# Altium project roneCPUBoard-v12.PrjPCB
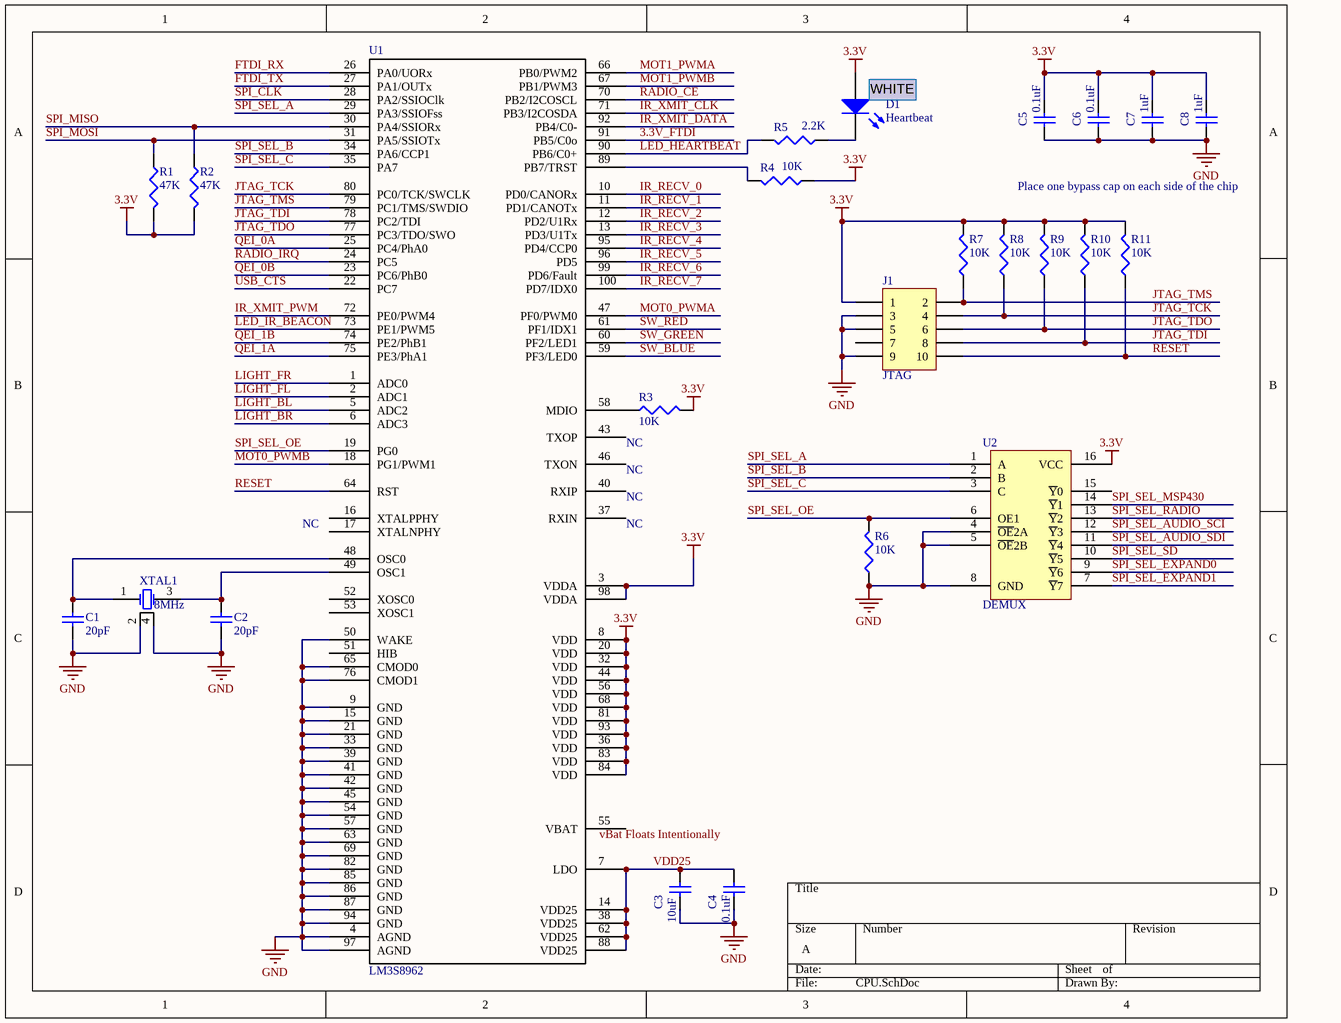
[diagram p0: CPU.SchDoc]
5 sheets, 126 parts. Net scope: global (net labels, ports and power ports of the same name join across sheets).
Board file: roneCPUBoard-v12.PcbDoc
Sheets:
  CPU.SchDoc
  USBHeaders.SchDoc
  LEDs.SchDoc
  LightSensorsButtons.SchDoc
  SoundChip.SchDoc

## Sheet CPU.SchDoc
size A; PageSetup: Record=PageOptions|CenterHorizontal=True|CenterVertical=True|PrintScale=1.05|XCorrection=1.00|YCorrection=1.00|PrintKind=1|BorderSize=5000000|LeftOffset=0|BottomOffset=0|Orientation=2|PaperLength=1000|PaperWidth=1000|Scale=100|PaperSource=262|PrintQuality=600|MediaType=1|DitherType=10|PaperKind=Letter|PrintScaleMode=1

### Parts
C1  value 20pF  [CAPC1005L]  (hidden comment: Cap Semi)
C2  value 20pF  [CAPC1005L]  (hidden comment: Cap Semi)
C3  value 10uF  [CAPC1608L]  (hidden comment: Cap Semi)
C4  value 0.1uF  [CAPC1005L]  (hidden comment: Cap Semi)
C5  value 0.1uF  [CAPC1005L]  (hidden comment: Cap Semi)
C6  value 0.1uF  [CAPC1005L]  (hidden comment: Cap Semi)
C7  value 1uF  [CAPC1608L]  (hidden comment: Cap Semi)
C8  value 1uF  [CAPC1608L]  (hidden comment: Cap Semi)
D1  Heartbeat  [SurfaceMount(603)]
J1  JTAG  [JTAG-10]
R1  value 47K  [RESC1608L]  (hidden comment: Res3)
R2  value 47K  [RESC1608L]  (hidden comment: Res3)
R3  value 10K  [RESC1608L]  (hidden comment: Res3)
R4  value 10K  [RESC1608L]  (hidden comment: Res3)
R5  value 2.2K  [RESC1608L]  (hidden comment: Res3)
R6  value 10K  [RESC1608L]  (hidden comment: Res3)
R7  value 10K  [RESC1608L]  (hidden comment: Res3)
R8  value 10K  [RESC1608L]  (hidden comment: Res3)
R9  value 10K  [RESC1608L]  (hidden comment: Res3)
R10  value 10K  [RESC1608L]  (hidden comment: Res3)
R11  value 10K  [RESC1608L]  (hidden comment: Res3)
U1  LM3S8962  [LQFP-100]
U2  DEMUX  [TSSOP-16]
XTAL1  8MHz  [CRYSTAL]

### Nets
3.3V: C5.2 C6.2 C7.2 C8.2 D1.1(A) J1.1 R1.2 R2.2 R3.2 R4.1 R7.2 R8.2 R9.2 R10.2 R11.2 U1.3(VDDA) U1.8(VDD) U1.20(VDD) U1.32(VDD) U1.36(VDD) U1.44(VDD) U1.56(VDD) U1.68(VDD) U1.81(VDD) U1.83(VDD) U1.84(VDD) U1.93(VDD) U1.98(VDDA) U2.16(VCC)
3.3V_FTDI: U1.91(PB5/C0o)
GND: C1.1 C2.1 C3.1 C4.1 C5.1 C6.1 C7.1 C8.1 J1.3 J1.5 J1.9 R6.1 U1.4(AGND) U1.9(GND) U1.15(GND) U1.21(GND) U1.33(GND) U1.39(GND) U1.41(GND) U1.42(GND) U1.45(GND) U1.50(WAKE) U1.54(GND) U1.57(GND) U1.63(GND) U1.65(CMOD0) U1.69(GND) U1.76(CMOD1) U1.82(GND) U1.85(GND) U1.86(GND) U1.87(GND) U1.94(GND) U1.97(AGND) U2.4(~{OE}2A) U2.5(~{OE}2B) U2.8(GND) XTAL1.2(GND) XTAL1.4(GND)
FTDI_RX: U1.26(PA0/UORx)
FTDI_TX: U1.27(PA1/OUTx)
IR_RECV_0: U1.10(PD0/CANORx)
IR_RECV_1: U1.11(PD1/CANOTx)
IR_RECV_2: U1.12(PD2/U1Rx)
IR_RECV_3: U1.13(PD3/U1Tx)
IR_RECV_4: U1.95(PD4/CCP0)
IR_RECV_5: U1.96(PD5)
IR_RECV_6: U1.99(PD6/Fault)
IR_RECV_7: U1.100(PD7/IDX0)
IR_XMIT_CLK: U1.71(PB3/I2COSDA)
IR_XMIT_DATA: U1.92(PB4/C0-)
IR_XMIT_PWM: U1.72(PE0/PWM4)
JTAG_TCK: J1.4 R8.1 U1.80(PC0/TCK/SWCLK)
JTAG_TDI: J1.8 R10.1 U1.78(PC2/TDI)
JTAG_TDO: J1.6 R9.1 U1.77(PC3/TDO/SWO)
JTAG_TMS: J1.2 R7.1 U1.79(PC1/TMS/SWDIO)
LED_HEARTBEAT: R5.2 U1.90(PB6/C0+)
LED_IR_BEACON: U1.73(PE1/PWM5)
LIGHT_BL: U1.5(ADC2)
LIGHT_BR: U1.6(ADC3)
LIGHT_FL: U1.2(ADC1)
LIGHT_FR: U1.1(ADC0)
MOT0_PWMA: U1.47(PF0/PWM0)
MOT0_PWMB: U1.18(PG1/PWM1)
MOT1_PWMA: U1.66(PB0/PWM2)
MOT1_PWMB: U1.67(PB1/PWM3)
QEI_0A: U1.25(PC4/PhA0)
QEI_0B: U1.23(PC6/PhB0)
QEI_1A: U1.75(PE3/PhA1)
QEI_1B: U1.74(PE2/PhB1)
RADIO_CE: U1.70(PB2/I2COSCL)
RADIO_IRQ: U1.24(PC5)
RESET: J1.10 R11.1 U1.64(RST)
SPI_CLK: U1.28(PA2/SSIOClk)
SPI_MISO: R2.1 U1.30(PA4/SSIORx)
SPI_MOSI: R1.1 U1.31(PA5/SSIOTx)
SPI_SEL_A: U1.29(PA3/SSIOFss) U2.1(A)
SPI_SEL_AUDIO_SCI: U2.12(~{Y}3)
SPI_SEL_AUDIO_SDI: U2.11(~{Y}4)
SPI_SEL_B: U1.34(PA6/CCP1) U2.2(B)
SPI_SEL_C: U1.35(PA7) U2.3(C)
SPI_SEL_EXPAND0: U2.9(~{Y}6)
SPI_SEL_EXPAND1: U2.7(~{Y}7)
SPI_SEL_MSP430: U2.14(~{Y}1)
SPI_SEL_OE: R6.2 U1.19(PG0) U2.6(OE1)
SPI_SEL_RADIO: U2.13(~{Y}2)
SPI_SEL_SD: U2.10(~{Y}5)
SW_BLUE: U1.59(PF3/LED0)
SW_GREEN: U1.60(PF2/LED1)
SW_RED: U1.61(PF1/IDX1)
USB_CTS: U1.22(PC7)
VDD25: C3.2 C4.2 U1.7(LDO) U1.14(VDD25) U1.38(VDD25) U1.62(VDD25) U1.88(VDD25)
NetC1_2: C1.2 U1.48(OSC0) XTAL1.1(OSC1)
NetC2_2: C2.2 U1.49(OSC1) XTAL1.3(OSC2)
NetD1_2: D1.2(K) R5.1
NetR3_1: R3.1 U1.58(MDIO)
NetR4_2: R4.2 U1.89(PB7/TRST)

Not connected (* = marked no-connect by the designer): J1 7; U1 16(XTALPPHY) 17(XTALNPHY) 37(RXIN) 40(RXIP) 43(TXOP) 46(TXON) 51(HIB) 52(XOSC0) 53(XOSC1) 55(VBAT); U2 15(~{Y}0)

### Notes on the sheet
- (near D1) WHITE
- Place one bypass cap on each side of the chip
- NC
- (near U1) NC
- (near U1) vBat Floats Intentionally

### Library data of the parts
C1-C8 = Cap Semi: Capacitor (Semiconductor SIM Model); Published: 8-Jun-2000; LatestRevisionDate: 29-May-2009; LatestRevisionNote: IPC-7351 Footprint Added.; PackageReference: C1206; Publisher: Altium Limited; PackageDescription: Chip Capacitor
D1 = LED
J1 = Header 5X2H: Header, 5-Pin, Dual row, Right Angle; LatestRevisionDate: 17-Jul-2002; LatestRevisionNote: Re-released for DXP Platform.; Publisher: Altium Limited
R1-R11 = Res3: Resistor; Published: 8-Jun-2000; LatestRevisionDate: 29-May-2009; LatestRevisionNote: IPC-7351 Footprint Added.; PackageReference: J1-0603; Publisher: Altium Limited; PackageDescription: Chip Resistor
XTAL1 = Crystal

## Sheet USBHeaders.SchDoc
size A
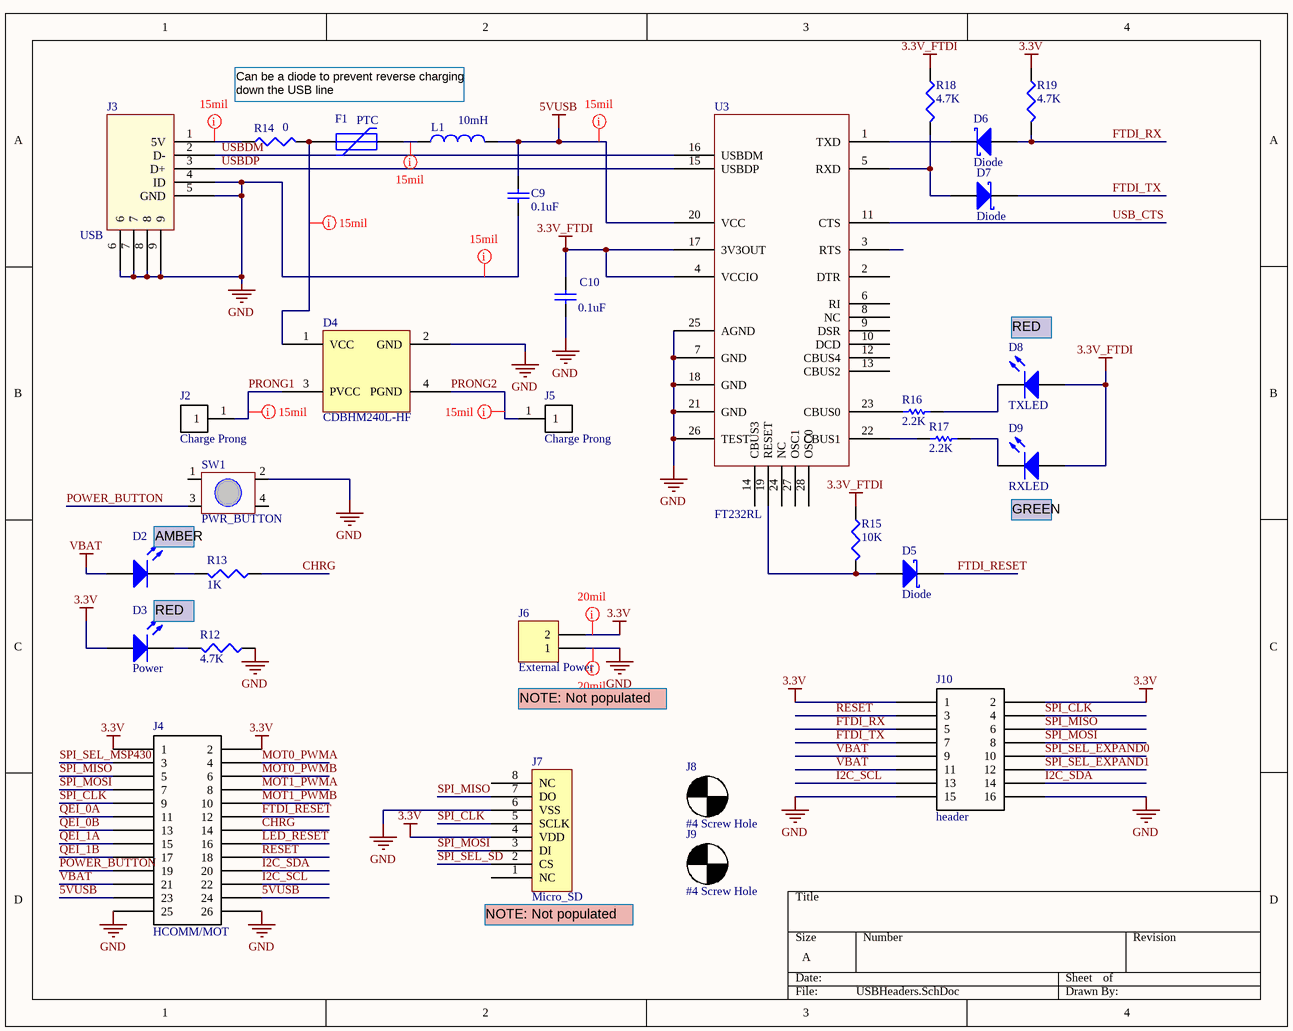
[diagram p1: USBHeaders.SchDoc]

### Parts
C9  value 0.1uF  [CAPC1005L]
C10  value 0.1uF  [CAPC1005L]
D2  Charge  [SurfaceMount(603)]  (value not drawn)
D3  Power  [SurfaceMount(603)]
D4  CDBHM240L-HF  [DIODEARRAY_2AMPS]
D5  Diode  [SurfaceMount(603)]
D6  Diode  [SurfaceMount(603)]
D7  Diode  [SurfaceMount(603)]
D8  TXLED  [SurfaceMount(603)]
D9  RXLED  [SurfaceMount(603)]
F1  PTC  [ERJ8G-1206]
J2  Charge Prong  [CHARGING_PRONG]
J3  USB  [USB Minib (thru-hole)]
J4  HCOMM/MOT  [HeaderSM 13x2]
J5  Charge Prong  [CHARGING_PRONG]
J6  External Power  [HDR1X2]
J7  Micro_SD  [MICRO_SD]
J8  #4 Screw Hole  [#4_Screw_Hole]
J9  #4 Screw Hole  [#4_Screw_Hole]
J10  header  [HEADERSM 8X2]
L1  value 10mH  [INDC2012L]  (hidden comment: Inductor)
R12  value 4.7K  [RESC1608L]  (hidden comment: Res3)
R13  value 1K  [RESC1608L]  (hidden comment: Res3)
R14  value 0  [RESC1608L]  (hidden comment: Res3)
R15  value 10K  [RESC1608L]  (hidden comment: Res3)
R16  value 2.2K  [RESC1608L]
R17  value 2.2K  [RESC1608L]
R18  value 4.7K  [RESC1608L]  (hidden comment: Res3)
R19  value 4.7K  [RESC1608L]  (hidden comment: Res3)
SW1  PWR_BUTTON  [SwitchTall-TL330]
U3  FT232RL  [SSOP-28]

### Nets
3.3V: D3.1(A) J4.1 J4.2 J6.2 J7.4(VDD) J10.1 J10.2 R19.1
3.3V_FTDI: C10.2 D8.1(A) D9.1(A) R15.1 R18.1 U3.4(VCCIO) U3.17(3V3OUT)
5VUSB: C9.2 J4.23 J4.24 L1.2 U3.20(VCC)
GND: C9.1 C10.1 D4.2(GND) J3.4(ID) J3.5(GND) J3.6 J3.7 J3.8 J3.9 J4.25 J4.26 J6.1 J7.6(VSS) J10.15 J10.16 R12.1 SW1.2 U3.7(GND) U3.18(GND) U3.21(GND) U3.25(AGND) U3.26(TEST)
VBAT: D2.1(A) J4.21 J10.9 J10.11
CHRG: J4.14 R13.1
FTDI_RESET: D5.1(K) J4.12
FTDI_RX: D6.2(A) J10.5 R19.2
FTDI_TX: D7.1(K) J10.7
I2C_SCL: J4.22 J10.13
I2C_SDA: J4.20 J10.14
LED_RESET: J4.16
MOT0_PWMA: J4.4
MOT0_PWMB: J4.6
MOT1_PWMA: J4.8
MOT1_PWMB: J4.10
POWER_BUTTON: J4.19 SW1.3
PRONG1: D4.3(PVCC) J2.1
PRONG2: D4.4(PGND) J5.1
QEI_0A: J4.11
QEI_0B: J4.13
QEI_1A: J4.15
QEI_1B: J4.17
RESET: J4.18 J10.3
SPI_CLK: J4.9 J7.5(SCLK) J10.4
SPI_MISO: J4.5 J7.7(DO) J10.6
SPI_MOSI: J4.7 J7.3(DI) J10.8
SPI_SEL_EXPAND0: J10.10
SPI_SEL_EXPAND1: J10.12
SPI_SEL_MSP430: J4.3
SPI_SEL_SD: J7.2(CS)
USB_CTS: U3.11(CTS)
USBDM: J3.2(D-) U3.16(USBDM)
USBDP: J3.3(D+) U3.15(USBDP)
NetD2_2: D2.2(K) R13.2
NetD3_2: D3.2(K) R12.2
NetD4_1: D4.1(VCC) F1.2 R14.2
NetD5_2: D5.2(A) R15.2 U3.19(RESET)
NetD6_1: D6.1(K) U3.1(TXD)
NetD7_2: D7.2(A) R18.2 U3.5(RXD)
NetD8_2: D8.2(K) R16.2
NetD9_2: D9.2(K) R17.2
NetF1_1: F1.1 L1.1
NetJ3_1: J3.1(5V) R14.1
NetR16_1: R16.1 U3.23(CBUS0)
NetR17_1: R17.1 U3.22(CBUS1)

Not connected (* = marked no-connect by the designer): J7 1(NC) 8(NC); SW1 1 4; U3 2(DTR) 3(RTS) 6(RI) 8(NC) 9(DSR) 10(DCD) 12(CBUS4) 13(CBUS2) 14(CBUS3) 24(NC) 27(OSC1) 28(OSC0)

### Layout directives
rule Width Constraint [Pref Width = 15mil    Min Width = 8mil    Max Width = 30mil]: 3.3V
rule Width Constraint [Pref Width = 8mil    Min Width = 8mil    Max Width = 15mil]: 5VUSB, GND, NetJ3_1
rule Width Constraint [Pref Width = 15mil    Min Width = 15mil    Max Width = 20mil]: NetD4_1, NetF1_1
rule Width Constraint [Pref Width = 15mil    Min Width = 8mil    Max Width = 20mil]: PRONG1, PRONG2
rule Width Constraint [Pref Width = 15mil    Min Width = 8mil    Max Width = 100mil]: GND

### Notes on the sheet
- Can be a diode to prevent reverse charging down the USB line
- (near D8) RED
- (near D9) GREEN
- AMBER
- RED
- (near J6) NOTE: Not populated
- (near J7) NOTE: Not populated

### Library data of the parts
C9 C10 = Cap: Capacitor; Published: 8-Jun-2000; LatestRevisionDate: 17-Jul-2002; LatestRevisionNote: Re-released for DXP Platform.; PackageReference: RAD-0.3; Publisher: Altium Limited
D2 D8 D9 = LED2: Typical RED, GREEN, YELLOW, AMBER GaAs LED; Published: 8-Jun-2000; LatestRevisionDate: 17-Jul-2002; LatestRevisionNote: Re-released for DXP Platform.; PackageVersion: Feb-2002; PackageReference: 3.2X1.6X1.1; Publisher: Altium Limited
D3 = LED
D4 = DiodeArray2Amps: MPN: CDBHM240L-HF
D5-D7 = SchottkeyDiode
F1 = PTC_FUSE: Fuse; Published: 8-Jun-2000; LatestRevisionDate: 17-Jul-2002; LatestRevisionNote: Re-released for DXP Platform.; PackageReference: PIN-W2/E2.8; Publisher: Altium Limited
J2 J5 = CHARGE_PRONG: Charging Prong Hole with Plating
J3 = USB-ConnTH
J4 = HCOMM/HMOT: Header, 2X20, 50mil, IDC
J6 = Header 2: Header, 2-Pin; LatestRevisionDate: 17-Jul-2002; LatestRevisionNote: Re-released for DXP Platform.; Publisher: Altium Limited
J8 J9 = Mechanical_Hole: A mechanical hole for mounting the board
J10 = HEADER 8X2
L1 = Inductor: Code_IEC: 1005; Published: 8-Jun-2000; LatestRevisionDate: 29-May-2009; LatestRevisionNote: IPC-7351 Footprint Added.; PackageReference: 0402-A; Publisher: Altium Limited; PackageDescription: Chip Inductor; Code_JEITA: 0402
R12-R15 R18 R19 = Res3: Resistor; Published: 8-Jun-2000; LatestRevisionDate: 29-May-2009; LatestRevisionNote: IPC-7351 Footprint Added.; PackageReference: J1-0603; Publisher: Altium Limited; PackageDescription: Chip Resistor
R16 R17 = Res1: Resistor; Published: 8-Jun-2000; LatestRevisionDate: 17-Jul-2002; LatestRevisionNote: Re-released for DXP Platform.; PackageReference: AXIAL-0.3; Publisher: Altium Limited
SW1 = Switch-TL330

## Sheet LEDs.SchDoc
size A
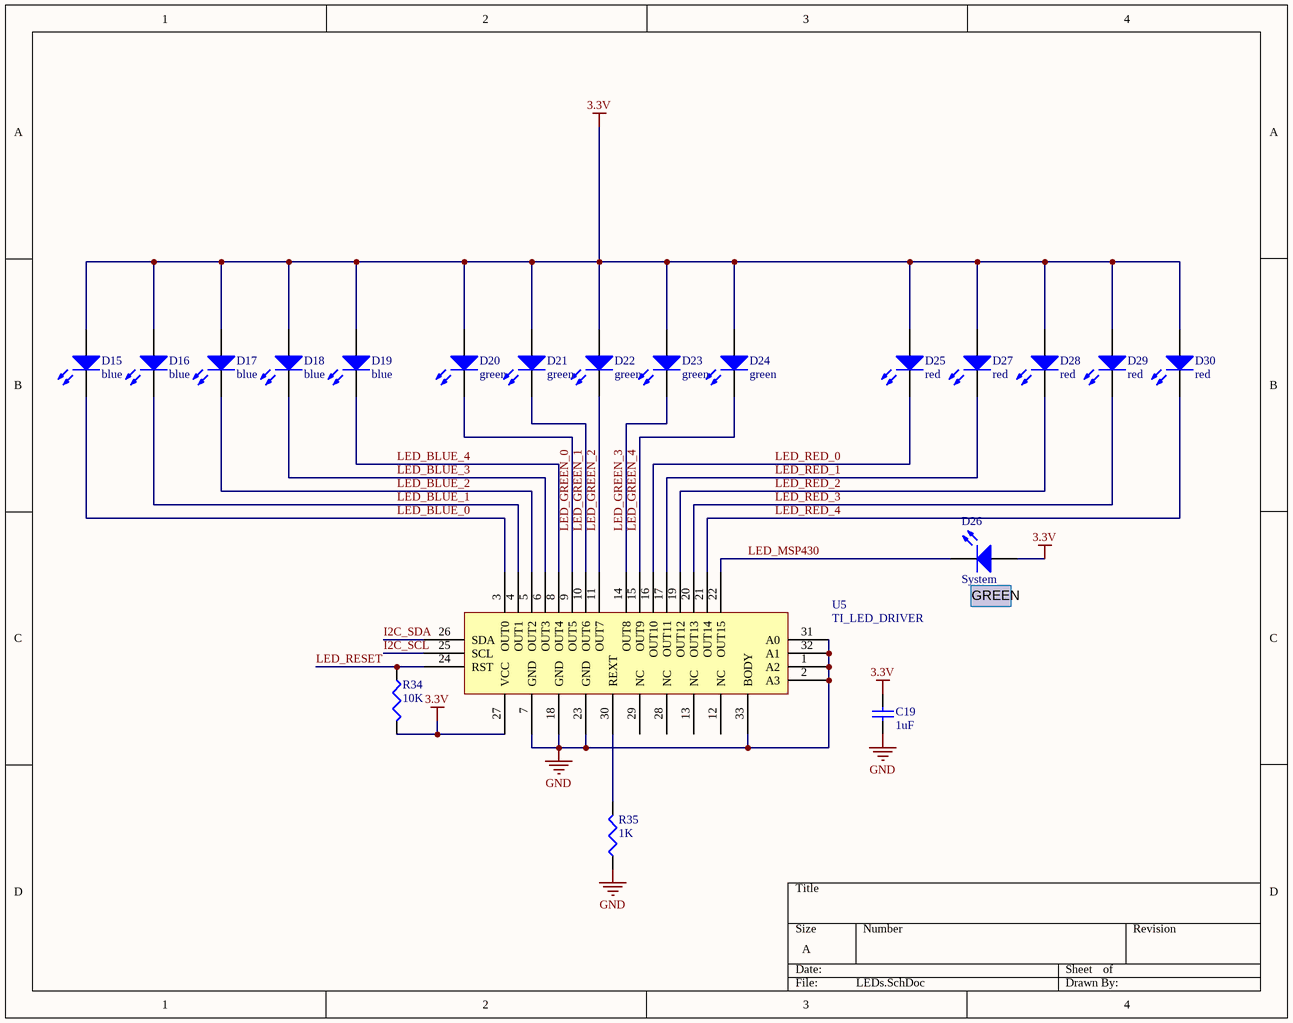
[diagram p2: LEDs.SchDoc]

### Parts
C19  value 1uF  [CAPC1608L]  (hidden comment: Cap Semi)
D15  blue  [SurfaceMount(603)]
D16  blue  [SurfaceMount(603)]
D17  blue  [SurfaceMount(603)]
D18  blue  [SurfaceMount(603)]
D19  blue  [SurfaceMount(603)]
D20  green  [SurfaceMount(603)]
D21  green  [SurfaceMount(603)]
D22  green  [SurfaceMount(603)]
D23  green  [SurfaceMount(603)]
D24  green  [SurfaceMount(603)]
D25  red  [SurfaceMount(603)]
D26  System  [SurfaceMount(603)]
D27  red  [SurfaceMount(603)]
D28  red  [SurfaceMount(603)]
D29  red  [SurfaceMount(603)]
D30  red  [SurfaceMount(603)]
R34  value 10K  [RESC1608L]  (hidden comment: Res3)
R35  value 1K  [RESC1608L]  (hidden comment: Res3)
U5  TI_LED_DRIVER  [QFN32-LEDTLC59116]

### Nets
3.3V: C19.2 D15.1(A) D16.1(A) D17.1(A) D18.1(A) D19.1(A) D20.1(A) D21.1(A) D22.1(A) D23.1(A) D24.1(A) D25.1(A) D26.1(A) D27.1(A) D28.1(A) D29.1(A) D30.1(A) R34.2 U5.27(VCC)
GND: C19.1 R35.1 U5.1(A2) U5.2(A3) U5.7(GND) U5.18(GND) U5.23(GND) U5.31(A0) U5.32(A1) U5.33(BODY)
I2C_SCL: U5.25(SCL)
I2C_SDA: U5.26(SDA)
LED_BLUE_0: D15.2(K) U5.3(OUT0)
LED_BLUE_1: D16.2(K) U5.4(OUT1)
LED_BLUE_2: D17.2(K) U5.5(OUT2)
LED_BLUE_3: D18.2(K) U5.6(OUT3)
LED_BLUE_4: D19.2(K) U5.8(OUT4)
LED_GREEN_0: D20.2(K) U5.9(OUT5)
LED_GREEN_1: D21.2(K) U5.10(OUT6)
LED_GREEN_2: D22.2(K) U5.11(OUT7)
LED_GREEN_3: D23.2(K) U5.14(OUT8)
LED_GREEN_4: D24.2(K) U5.15(OUT9)
LED_MSP430: D26.2(K) U5.22(OUT15)
LED_RED_0: D25.2(K) U5.16(OUT10)
LED_RED_1: D27.2(K) U5.17(OUT11)
LED_RED_2: D28.2(K) U5.19(OUT12)
LED_RED_3: D29.2(K) U5.20(OUT13)
LED_RED_4: D30.2(K) U5.21(OUT14)
LED_RESET: R34.1 U5.24(RST)
NetR35_2: R35.2 U5.30(REXT)

Not connected (* = marked no-connect by the designer): U5 12(NC) 13(NC) 28(NC) 29(NC)

### Notes on the sheet
- (near D26) GREEN

### Library data of the parts
C19 = Cap Semi: Capacitor (Semiconductor SIM Model); Published: 8-Jun-2000; LatestRevisionDate: 29-May-2009; LatestRevisionNote: IPC-7351 Footprint Added.; PackageReference: C1206; Publisher: Altium Limited; PackageDescription: Chip Capacitor
D15-D30 = LED
R34 R35 = Res3: Resistor; Published: 8-Jun-2000; LatestRevisionDate: 29-May-2009; LatestRevisionNote: IPC-7351 Footprint Added.; PackageReference: J1-0603; Publisher: Altium Limited; PackageDescription: Chip Resistor
U5 = TLC59116LEDDRIVER

## Sheet LightSensorsButtons.SchDoc
size A
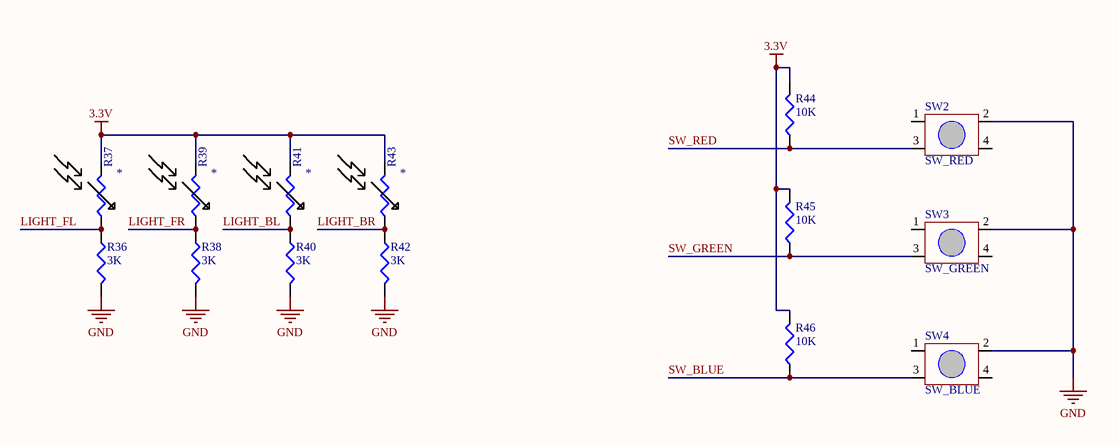
[diagram p3: LightSensorsButtons.SchDoc]

### Parts
R36  value 3K  [RESC1608L]  (hidden comment: Res3)
R37  photoresistor  [photoresistor]  (value not drawn)
R38  value 3K  [RESC1608L]  (hidden comment: Res3)
R39  photoresistor  [photoresistor]  (value not drawn)
R40  value 3K  [RESC1608L]  (hidden comment: Res3)
R41  photoresistor  [photoresistor]  (value not drawn)
R42  value 3K  [RESC1608L]  (hidden comment: Res3)
R43  photoresistor  [photoresistor]  (value not drawn)
R44  value 10K  [RESC1608L]  (hidden comment: Res3)
R45  value 10K  [RESC1608L]  (hidden comment: Res3)
R46  value 10K  [RESC1608L]  (hidden comment: Res3)
SW2  SW_RED  [SwitchTall-TL330]
SW3  SW_GREEN  [SwitchTall-TL330]
SW4  SW_BLUE  [SwitchTall-TL330]

### Nets
3.3V: R37.2 R39.2 R41.2 R43.2 R44.2 R45.2 R46.2
GND: R36.2 R38.2 R40.2 R42.2 SW2.2 SW3.2 SW4.2
LIGHT_BL: R40.1 R41.1
LIGHT_BR: R42.1 R43.1
LIGHT_FL: R36.1 R37.1
LIGHT_FR: R38.1 R39.1
SW_BLUE: R46.1 SW4.3
SW_GREEN: R45.1 SW3.3
SW_RED: R44.1 SW2.3

Not connected (* = marked no-connect by the designer): SW2 1 4; SW3 1 4; SW4 1 4

### Library data of the parts
R36 R38 R40 R42 R44-R46 = Res3: Resistor; Published: 8-Jun-2000; LatestRevisionDate: 29-May-2009; LatestRevisionNote: IPC-7351 Footprint Added.; PackageReference: J1-0603; Publisher: Altium Limited; PackageDescription: Chip Resistor
SW2-SW4 = Switch-TL330
R37 R39 R41 R43 = photoresistor: Value: *

## Sheet SoundChip.SchDoc
size A
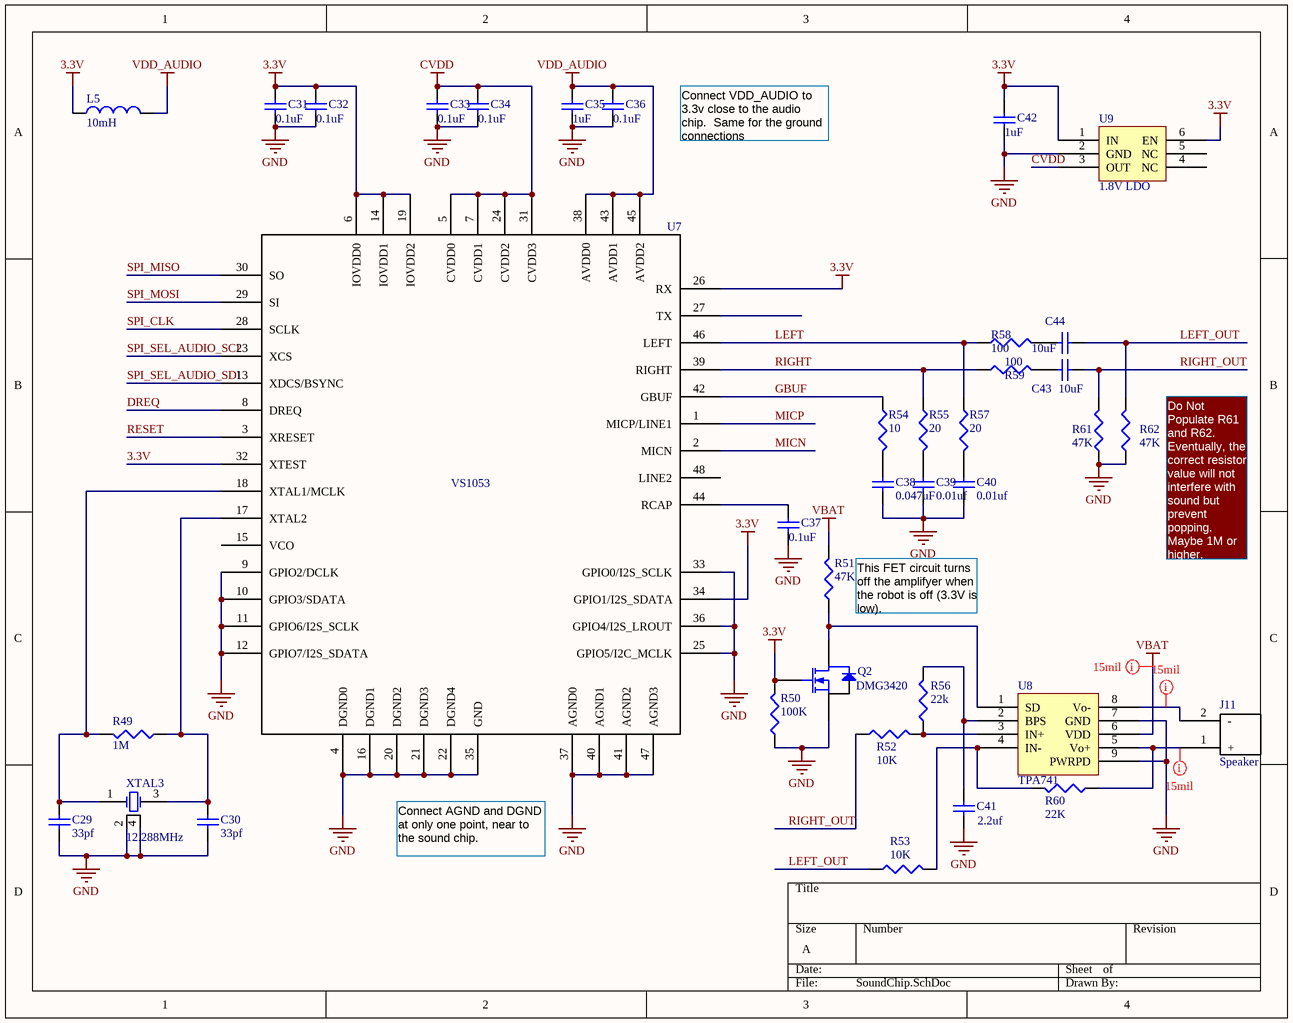
[diagram p4: SoundChip.SchDoc]

### Parts
C29  value 33pf  [CAPC1005L]  (hidden comment: Cap Semi)
C30  value 33pf  [CAPC1005L]  (hidden comment: Cap Semi)
C31  value 0.1uF  [CAPC1005L]  (hidden comment: Cap Semi)
C32  value 0.1uF  [CAPC1005L]  (hidden comment: Cap Semi)
C33  value 0.1uF  [CAPC1005L]  (hidden comment: Cap Semi)
C34  value 0.1uF  [CAPC1005L]  (hidden comment: Cap Semi)
C35  value 1uF  [CAPC1608L]  (hidden comment: Cap Semi)
C36  value 0.1uF  [CAPC1005L]  (hidden comment: Cap Semi)
C37  value 0.1uF  [CAPC1005L]  (hidden comment: Cap Semi)
C38  value 0.047uF  [CAPC1005L]  (hidden comment: Cap Semi)
C39  value 0.01uf  [CAPC1005L]  (hidden comment: Cap Semi)
C40  value 0.01uf  [CAPC1005L]  (hidden comment: Cap Semi)
C41  value 2.2uf  [J1-0603]  (hidden comment: Cap Semi)
C42  value 1uF  [CAPC1608L]  (hidden comment: Cap Semi)
C43  value 10uF  [CAPC1608L]  (hidden comment: Cap Semi)
C44  value 10uF  [CAPC1608L]  (hidden comment: Cap Semi)
J11  Speaker  [BatteryConnJST]
L5  value 10mH  [INDC2012L]  (hidden comment: Inductor)
Q2  MPN: DMG3420  [SOT-23]  (hidden comment: N-Mosfet)
R49  value 1M  [RESC1608L]  (hidden comment: Res3)
R50  value 100K  [RESC1608L]  (hidden comment: Res3)
R51  value 47K  [J1-0603]  (hidden comment: Res3)
R52  value 10K  [RESC1608L]
R53  value 10K  [RESC1608L]  (hidden comment: Res3)
R54  value 10  [RESC1608L]  (hidden comment: Res3)
R55  value 20  [RESC1608L]  (hidden comment: Res3)
R56  value 22k  [RESC1608L]
R57  value 20  [RESC1608L]  (hidden comment: Res3)
R58  value 100  [RESC1608L]  (hidden comment: Res3)
R59  value 100  [RESC1608L]  (hidden comment: Res3)
R60  value 22K  [RESC1608L]  (hidden comment: Res3)
R61  value 47K  [RESC1608L]  (hidden comment: Res3)
R62  value 47K  [RESC1608L]  (hidden comment: Res3)
U7  VS1053  [LQFP-48]
U8  TPA741  [audio amp]
U9  1.8V LDO  [WFDFN-6]
XTAL3  12.288MHz  [CRYSTAL]

### Nets
3.3V: C31.2 C32.2 C42.1 L5.2 Q2.1(G) R50.2 U7.6(IOVDD0) U7.14(IOVDD1) U7.19(IOVDD2) U7.26(RX) U7.32(XTEST) U7.34(GPIO1/I2S_SDATA) U9.1(IN) U9.6(EN)
CVDD: C33.2 C34.2 U7.5(CVDD0) U7.7(CVDD1) U7.24(CVDD2) U7.31(CVDD3) U9.3(OUT)
GND: C29.2 C30.2 C31.1 C32.1 C33.1 C34.1 C35.2 C36.1 C37.1 C38.2 C39.2 C40.2 C41.1 C42.2 Q2.2(S) R50.1 R61.1 R62.1 U7.4(DGND0) U7.9(GPIO2/DCLK) U7.10(GPIO3/SDATA) U7.11(GPIO6/I2S_SCLK) U7.12(GPIO7/I2S_SDATA) U7.16(DGND1) U7.20(DGND2) U7.21(DGND3) U7.22(DGND4) U7.25(GPIO5/I2C_MCLK) U7.33(GPIO0/I2S_SCLK) U7.35(GND) U7.36(GPIO4/I2S_LROUT) U7.37(AGND0) U7.40(AGND1) U7.41(AGND2) U7.47(AGND3) U8.7(GND) U8.9(PWRPD) U9.2(GND) XTAL3.2(GND) XTAL3.4(GND)
VBAT: R51.2 U8.6(VDD)
VDD_AUDIO: C35.1 C36.2 L5.1 U7.38(AVDD0) U7.43(AVDD1) U7.45(AVDD2)
DREQ: U7.8(DREQ)
GBUF: R54.1 U7.42(GBUF)
LEFT: R57.1 R58.1 U7.46(LEFT)
LEFT_OUT: C44.1 R53.1 R62.2
MICN: U7.2(MICN)
MICP: U7.1(MICP/LINE1)
RESET: U7.3(XRESET)
RIGHT: R55.1 R59.1 U7.39(RIGHT)
RIGHT_OUT: C43.1 R52.1 R61.2
SPI_CLK: U7.28(SCLK)
SPI_MISO: U7.30(SO)
SPI_MOSI: U7.29(SI)
SPI_SEL_AUDIO_SCI: U7.23(XCS)
SPI_SEL_AUDIO_SDI: U7.13(XDCS/BSYNC)
NetC29_1: C29.1 R49.2 U7.18(XTAL1/MCLK) XTAL3.1(OSC1)
NetC30_1: C30.1 R49.1 U7.17(XTAL2) XTAL3.3(OSC2)
NetC37_2: C37.2 U7.44(RCAP)
NetC38_1: C38.1 R54.2
NetC39_1: C39.1 R55.2
NetC40_1: C40.1 R57.2
NetC41_2: C41.2 R56.2 U8.2(BPS)
NetC43_2: C43.2 R59.2
NetC44_2: C44.2 R58.2
NetJ11_1: J11.1(+) R60.1 U8.5(Vo+)
NetJ11_2: J11.2(-) U8.8(Vo-)
NetQ2_3: Q2.3(D) R51.1 U8.1(SD)
NetR52_2: R52.2 R56.1 U8.3(IN+)
NetR53_2: R53.2 R60.2 U8.4(IN-)

Not connected (* = marked no-connect by the designer): U7 15(VCO) 27(TX) 48(LINE2); U9 4(NC) 5(NC)

### Layout directives
rule Width Constraint [Pref Width = 15mil    Min Width = 8mil    Max Width = 20mil]: NetJ11_1, NetJ11_2, VBAT

### Notes on the sheet
- Connect VDD_AUDIO to 3.3v close to the audio chip.  Same for the ground connections
- (near R62) Do Not Populate R61 and R62. Eventually, the correct resistor value will not interfere with sound but prevent popping. Maybe 1M or higher.
- (near R51) This FET circuit turns off the amplifyer when the robot is off (3.3V is low).
- Connect AGND and DGND at only one point, near to the sound chip.

### Library data of the parts
C29-C44 = Cap Semi: Capacitor (Semiconductor SIM Model); Published: 8-Jun-2000; LatestRevisionDate: 29-May-2009; LatestRevisionNote: IPC-7351 Footprint Added.; PackageReference: C1206; Publisher: Altium Limited; PackageDescription: Chip Capacitor
J11 = BatteryConnJST
L5 = Inductor: Code_IEC: 1005; Published: 8-Jun-2000; LatestRevisionDate: 29-May-2009; LatestRevisionNote: IPC-7351 Footprint Added.; PackageReference: 0402-A; Publisher: Altium Limited; PackageDescription: Chip Inductor; Code_JEITA: 0402
R49-R62 = Res3: Resistor; Published: 8-Jun-2000; LatestRevisionDate: 29-May-2009; LatestRevisionNote: IPC-7351 Footprint Added.; PackageReference: J1-0603; Publisher: Altium Limited; PackageDescription: Chip Resistor
U8 = Audio Amp TPA741
U9 = 1.8V_LDO
XTAL3 = Crystal

## Nets that join several sheets
3.3V: CPU (29 pins), USBHeaders (8 pins), LEDs (19 pins), LightSensorsButtons (7 pins), SoundChip (14 pins)
3.3V_FTDI: CPU (U1.91), USBHeaders (7 pins)
GND: CPU (39 pins), USBHeaders (22 pins), LEDs (10 pins), LightSensorsButtons (7 pins), SoundChip (40 pins)
VBAT: USBHeaders (D2.1 J4.21 J10.9 J10.11), SoundChip (R51.2 U8.6)
FTDI_RX: CPU (U1.26), USBHeaders (D6.2 J10.5 R19.2)
FTDI_TX: CPU (U1.27), USBHeaders (D7.1 J10.7)
I2C_SCL: USBHeaders (J4.22 J10.13), LEDs (U5.25)
I2C_SDA: USBHeaders (J4.20 J10.14), LEDs (U5.26)
LED_RESET: USBHeaders (J4.16), LEDs (R34.1 U5.24)
LIGHT_BL: CPU (U1.5), LightSensorsButtons (R40.1 R41.1)
LIGHT_BR: CPU (U1.6), LightSensorsButtons (R42.1 R43.1)
LIGHT_FL: CPU (U1.2), LightSensorsButtons (R36.1 R37.1)
LIGHT_FR: CPU (U1.1), LightSensorsButtons (R38.1 R39.1)
MOT0_PWMA: CPU (U1.47), USBHeaders (J4.4)
MOT0_PWMB: CPU (U1.18), USBHeaders (J4.6)
MOT1_PWMA: CPU (U1.66), USBHeaders (J4.8)
MOT1_PWMB: CPU (U1.67), USBHeaders (J4.10)
QEI_0A: CPU (U1.25), USBHeaders (J4.11)
QEI_0B: CPU (U1.23), USBHeaders (J4.13)
QEI_1A: CPU (U1.75), USBHeaders (J4.15)
QEI_1B: CPU (U1.74), USBHeaders (J4.17)
RESET: CPU (J1.10 R11.1 U1.64), USBHeaders (J4.18 J10.3), SoundChip (U7.3)
SPI_CLK: CPU (U1.28), USBHeaders (J4.9 J7.5 J10.4), SoundChip (U7.28)
SPI_MISO: CPU (R2.1 U1.30), USBHeaders (J4.5 J7.7 J10.6), SoundChip (U7.30)
SPI_MOSI: CPU (R1.1 U1.31), USBHeaders (J4.7 J7.3 J10.8), SoundChip (U7.29)
SPI_SEL_AUDIO_SCI: CPU (U2.12), SoundChip (U7.23)
SPI_SEL_AUDIO_SDI: CPU (U2.11), SoundChip (U7.13)
SPI_SEL_EXPAND0: CPU (U2.9), USBHeaders (J10.10)
SPI_SEL_EXPAND1: CPU (U2.7), USBHeaders (J10.12)
SPI_SEL_MSP430: CPU (U2.14), USBHeaders (J4.3)
SPI_SEL_SD: CPU (U2.10), USBHeaders (J7.2)
SW_BLUE: CPU (U1.59), LightSensorsButtons (R46.1 SW4.3)
SW_GREEN: CPU (U1.60), LightSensorsButtons (R45.1 SW3.3)
SW_RED: CPU (U1.61), LightSensorsButtons (R44.1 SW2.3)
USB_CTS: CPU (U1.22), USBHeaders (U3.11)